# Altium schematic sheet Lora_module_CPU.SchDoc
size A4
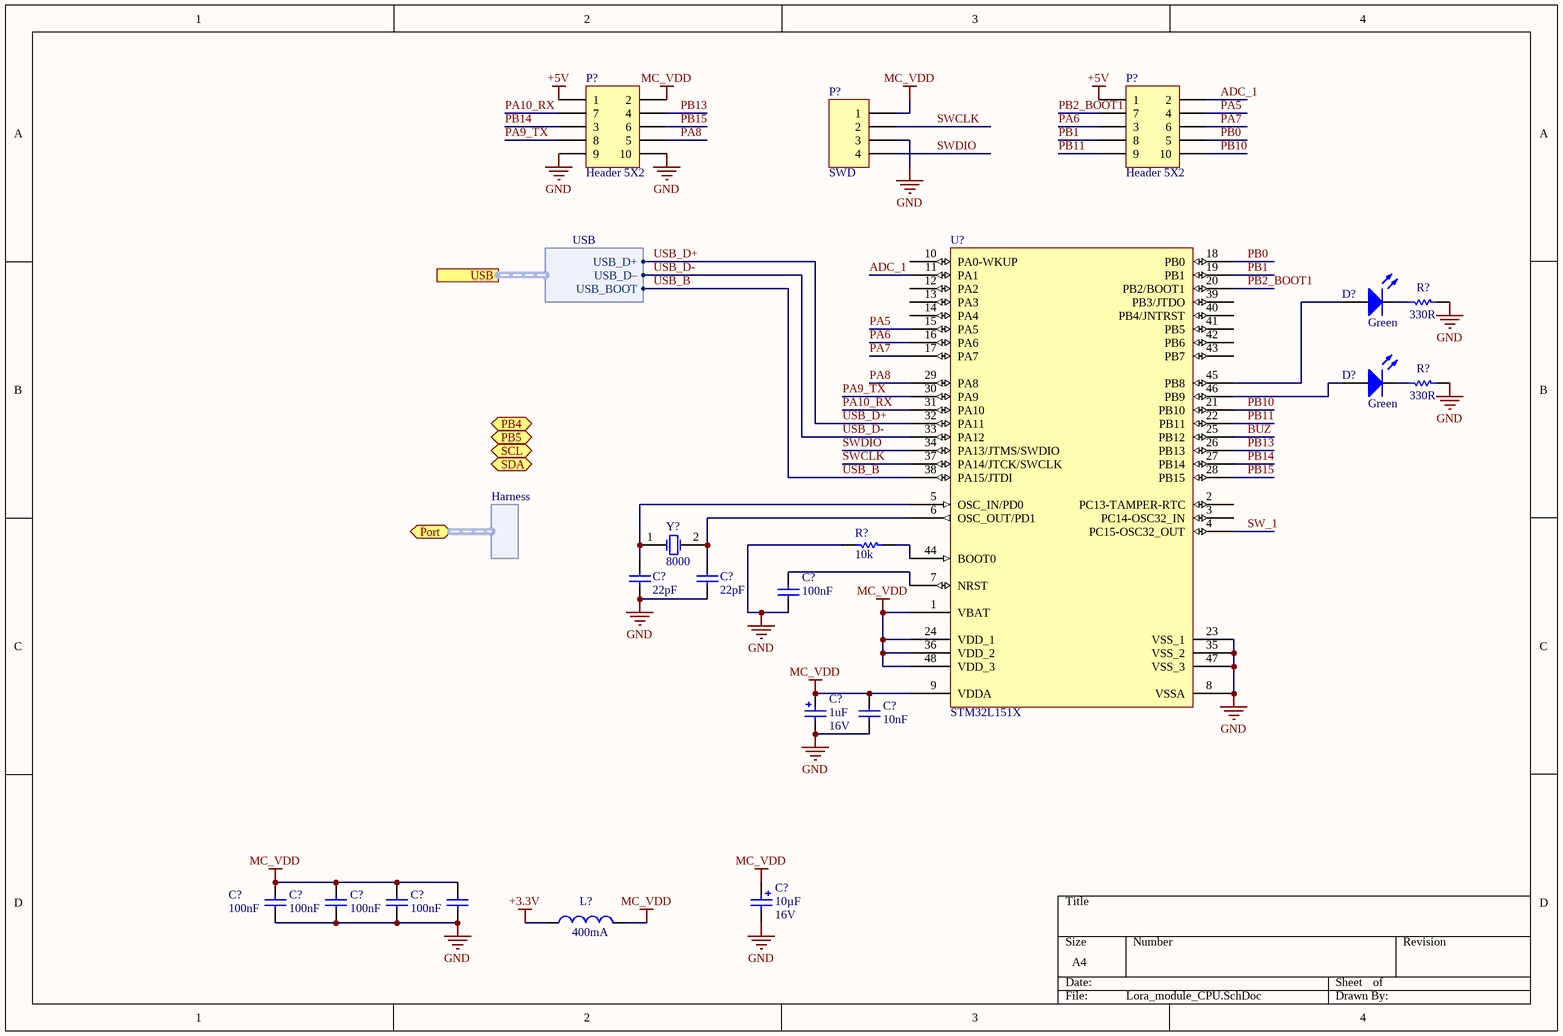
[diagram p0: Lora_module_CPU.SchDoc]

## Parts
(Parts that share a designator on the sheet are numbered #1, #2 ... from top to bottom, then left to right.)
C?#1  value 22pF  [SMD(0805)]  (hidden comment: Cap)
C?#2  value 22pF  [SMD(0805)]  (hidden comment: Cap)
C?#3  Capacitance: 100nF  [Cap 0603]  (hidden comment: Capacitor)
C?#4  Capacitance: 1uF  Voltage Rating: 16V  [Tantalum 3216 A]  (hidden comment: Capacitor Polarized)
C?#5  Capacitance: 10nF  [Cap 0603]  (hidden comment: Capacitor)
C?#6  Capacitance: 10µF  Voltage - Rated: 16V  [Tantalum 3216 A]  (hidden comment: Capacitor Polarized)
C?#7  Capacitance: 100nF  [Cap 0603]  (hidden comment: Capacitor)
C?#8  Capacitance: 100nF  [Cap 0603]  (hidden comment: Capacitor)
C?#9  Capacitance: 100nF  [Cap 0603]  (hidden comment: Capacitor)
C?#10  Capacitance: 100nF  [Cap 0603]  (hidden comment: Capacitor)
D?#1  Colour: Green  [Led 0805 green]  (hidden comment: LED)
D?#2  Colour: Green  [Led 0805 green]  (hidden comment: LED)
L?  Current Rating (Max): 400mA  [0603]  (hidden comment: Inductor)
P?#1  Header 5X2  [HDR2X5]
P?#2  Header 5X2  [HDR2X5]
P?#3  SWD  [Header 1X4]
R?#1  Resistance: 330R  [Res-0603]  (hidden comment: Res1)
R?#2  Resistance: 330R  [Res-0603]  (hidden comment: Res1)
R?#3  Resistance: 10k  [Res-0603]  (hidden comment: Res1)
U?  STM32L151X  [LQFP48_N]
Y?  8000  [XTAL1]

## Ports
PB4 (bidir), PB5, Port (harness Harness), SCL, SDA, USB (harness USB)

## Harnesses
Harness: 
USB: USB_BOOT, USB_D–, USB_D+

## Nets
+3.3V: L?.1
+5V: P?#1.1 P?#2.1
GND: C?#1.1 C?#2.1 C?#3.1 C?#4.2 C?#5.1 C?#6.2 C?#7.1 C?#8.1 C?#9.1 C?#10.1 P?#1.9 P?#1.10 P?#3.3 R?#1.2 R?#2.2 R?#3.2 U?.8(VSSA) U?.23(VSS_1) U?.35(VSS_2) U?.47(VSS_3)
MC_VDD: C?#4.1 C?#5.2 C?#6.1 C?#7.2 C?#8.2 C?#9.2 C?#10.2 L?.2 P?#1.2 P?#3.1 U?.1(VBAT) U?.9(VDDA) U?.24(VDD_1) U?.36(VDD_2) U?.48(VDD_3)
ADC_1: P?#2.2 U?.11(PA1)
BUZ: U?.25(PB12)
PA5: P?#2.4 U?.15(PA5)
PA6: P?#2.3 U?.16(PA6)
PA7: P?#2.6 U?.17(PA7)
PA8: P?#1.5 U?.29(PA8)
PA9_TX: P?#1.8 U?.30(PA9)
PA10_RX: P?#1.7 U?.31(PA10)
PB0: P?#2.5 U?.18(PB0)
PB1: P?#2.8 U?.19(PB1)
PB2_BOOT1: P?#2.7 U?.20(PB2/BOOT1)
PB10: P?#2.10 U?.21(PB10)
PB11: P?#2.9 U?.22(PB11)
PB13: P?#1.4 U?.26(PB13)
PB14: P?#1.3 U?.27(PB14)
PB15: P?#1.6 U?.28(PB15)
SW_1: U?.4(PC15-OSC32_OUT)
SWCLK: P?#3.2 U?.37(PA14/JTCK/SWCLK)
SWDIO: P?#3.4 U?.34(PA13/JTMS/SWDIO)
USB_B: U?.38(PA15/JTDI) ; port USB.USB_BOOT
USB_D+: U?.32(PA11) ; port USB.USB_D+
USB_D-: U?.33(PA12) ; port USB.USB_D–
NetC?#1_2: C?#1.2 U?.5(OSC_IN/PD0) Y?.1(OSC1)
NetC?#2_2: C?#2.2 U?.6(OSC_OUT/PD1) Y?.2(OSC2)
NetC?#3_2: C?#3.2 U?.7(NRST)
NetD?#1_1: D?#1.1(A) U?.45(PB8)
NetD?#1_2: D?#1.2(K) R?#1.1
NetD?#2_1: D?#2.1(A) U?.46(PB9)
NetD?#2_2: D?#2.2(K) R?#2.1
NetR?#3_1: R?#3.1 U?.44(BOOT0)

Not connected (* = marked no-connect by the designer): U? 2(PC13-TAMPER-RTC) 3(PC14-OSC32_IN) 10(PA0-WKUP) 12(PA2) 13(PA3) 14(PA4) 39(PB3/JTDO) 40(PB4/JNTRST) 41(PB5) 42(PB6) 43(PB7)

## Library data of the parts
C?#1 C?#2 = Cap: Capacitor
C?#3 C?#7-C?#10 = 1: Chip Capacitor Nonpolar; Manufacturer: Samsung; Manufacturer Part Number: CL10B104KB8NNNC; Material: Ceramic; Dielectric: X7R; Tolerance: 10%; Voltage Rating: 50V; ComponentLink1URL: http://www.kemet.com/docfinder?Partnumber=C0603C104K5RACTU; ComponentLink1Description: http://www.kemet.com/docfinder?Partnumber=C0603C104K5RACTU; Supplier 1: Digi-Key; Supplier Part Number 1: 1276-1000-1-ND; RoHS: Yes; Stock 1: 17762403; Pricing 1: 1 = 0,10000, 10 = 0,02800, 100 = 0,01230, 500 = 0,00878, 1000 = 0,00690 (USD); Mount: Surface Mount; Case/Package: 0603; Case Code (Metric): 1608; Case Code (Imperial): 0603; Contact Plating: Tin; Min Operating Temperature: -55°C; Max Operating Temperature: 125°C; Package Quantity: 1; Packaging: Tape and Reel; Voltage: 50V; Voltage Rating (DC): 50V; Length: 1.6mm; Height: 0.8mm; Depth: 0.8mm; Width: 0.031inch; Thickness: 0.035inch; Radiation Hardening: No; Lead Free: Lead Free; ComponentLink2URL: https://datasheet.ciiva.com/25803/cl10b104kb8nnnc-25803393.pdf?src-supplier=Digi-Key; ComponentLink2Description: https://datasheet.ciiva.com/25803/cl10b104kb8nnnc-25803393.pdf?src-supplier=Digi-Key; ComponentLink3URL: https://datasheet.ciiva.com/26838/getdatasheetpartid-89097-26838411.pdf?src-supplier=Verical; ComponentLink3Description: https://datasheet.ciiva.com/26838/getdatasheetpartid-89097-26838411.pdf?src-supplier=Verical; ComponentLink4URL: https://datasheet.ciiva.com/29198/456651-da-01-en-vs-kondensator-0605-29198839.pdf?src-supplier=Conrad; ComponentLink4Description: https://datasheet.ciiva.com/29198/456651-da-01-en-vs-kondensator-0605-29198839.pdf?src-supplier=Conrad
C?#4 = 2: Tantalum Capacitor; Manufacturer: Vishay Sprague; Manufacturer Part Number: 293D105X9016A2TE3; Tolerance: 10%; ESR (Equivalent Series Resistance): 9.3R; Ripple Current: 90mA; Leakage Current: 500nA; Polarity: Polar; Dissipation Factor: 4%; ComponentLink1URL: http://www.kemet.com/Lists/ProductCatalog/Attachments/254/KEM_T2005_T491.pdf; ComponentLink1Description: http://www.kemet.com/Lists/ProductCatalog/Attachments/254/KEM_T2005_T491.pdf; Supplier 1: Digi-Key; Supplier Part Number 1: 718-1113-6-ND; Stock 1: 0; Pricing 1: 1=0.33, 10=0.228, 100=0.1369, 500=0.1027, 1000=0.08672 (USD); Mount: Surface Mount,PCB; Case/Package: 1206; Case Code (Metric): 3216; Case Code (Imperial): 1206; Dielectric Material: Tantalum; Min Operating Temperature: -55°C; Max Operating Temperature: 125°C; Packaging: Tape and Reel; Package Quantity: 1; Voltage Rating (DC): 16V; Termination: SMD/SMT; Voltage: 16V; Features: General Purpose; Length: 3.2mm; Height: 1.6mm; Width: 1.6mm; Height - Seated (Max): 0.071inch; Depth: 1.6mm; Radiation Hardening: No; REACH SVHC: Unknown; Lead Free: Lead Free; ComponentLink2URL: https://datasheet.ciiva.com/11793/0900766b80d97b37-11793487.pdf; ComponentLink2Description: https://datasheet.ciiva.com/11793/0900766b80d97b37-11793487.pdf; ComponentLink3URL: https://datasheet.ciiva.com/26328/453930-da-01-en-smd-kondensator-293d105x9016a2te3-2000st-26328789.pdf; ComponentLink3Description: https://datasheet.ciiva.com/26328/453930-da-01-en-smd-kondensator-293d105x9016a2te3-2000st-26328789.pdf; ComponentLink4URL: https://datasheet.ciiva.com/257/293d-257909.pdf; ComponentLink4Description: https://datasheet.ciiva.com/257/293d-257909.pdf; ComponentLink5URL: https://datasheet.ciiva.com/257/293d-257910.pdf; ComponentLink5Description: https://datasheet.ciiva.com/257/293d-257910.pdf; ComponentLink6URL: https://datasheet.ciiva.com/16199/293d-16199270.pdf; ComponentLink6Description: https://datasheet.ciiva.com/16199/293d-16199270.pdf; ComponentLink7URL: https://datasheet.ciiva.com/257/293d-257911.pdf; ComponentLink7Description: https://datasheet.ciiva.com/257/293d-257911.pdf; ComponentLink8URL: https://datasheet.ciiva.com/3003/293d-3003799.pdf; ComponentLink8Description: https://datasheet.ciiva.com/3003/293d-3003799.pdf; ComponentLink9URL: https://datasheet.ciiva.com/11244/293d-11244087.pdf; ComponentLink9Description: https://datasheet.ciiva.com/11244/293d-11244087.pdf; ComponentLink10URL: https://datasheet.ciiva.com/46382/1910915-46382039.pdf; ComponentLink10Description: https://datasheet.ciiva.com/46382/1910915-46382039.pdf; ComponentLink11URL: https://datasheet.ciiva.com/3003/293d-3003800.pdf; ComponentLink11Description: https://datasheet.ciiva.com/3003/293d-3003800.pdf; ComponentLink12URL: https://datasheet.ciiva.com/18445/70212567-18445480.pdf; ComponentLink12Description: https://datasheet.ciiva.com/18445/70212567-18445480.pdf; ComponentLink13URL: https://datasheet.ciiva.com/1463/438417-1463146.pdf; ComponentLink13Description: https://datasheet.ciiva.com/1463/438417-1463146.pdf; ComponentLink14URL: https://datasheet.ciiva.com/12884/293d-239871-12884475.pdf; ComponentLink14Description: https://datasheet.ciiva.com/12884/293d-239871-12884475.pdf; ComponentLink15URL: https://datasheet.ciiva.com/22695/438417-22695102.pdf; ComponentLink15Description: https://datasheet.ciiva.com/22695/438417-22695102.pdf; ComponentLink16URL: https://datasheet.ciiva.com/6071/1748031-6071279.pdf; ComponentLink16Description: https://datasheet.ciiva.com/6071/1748031-6071279.pdf
C?#5 = 1: Chip Capacitor Nonpolar; Manufacturer: Samsung; Manufacturer Part Number: CL10B103KB8WPNC; Voltage Rating: 50V; Tolerance: 10%; ComponentLink1URL: http://www.kemet.com/docfinder?Partnumber=C0603C104K5RACTU; ComponentLink1Description: http://www.kemet.com/docfinder?Partnumber=C0603C104K5RACTU; Supplier 1: Digi-Key; Supplier Part Number 1: 1276-6841-6-ND; Stock 1: 11590; Pricing 1: 1=0.1, 10=0.076, 100=0.0338, 500=0.02416, 1000=0.01898 (USD); Mount: Surface Mount; Case/Package: 0603; Case Code (Metric): 1608; Case Code (Imperial): 0603; Min Operating Temperature: -55°C; Max Operating Temperature: 125°C; Packaging: Tape and Reel; Length: 0.063inch; Width: 0.031inch; Thickness: 0.035inch; Lead Free: Lead Free
C?#6 = 2: Tantalum Capacitor; Manufacturer: Kemet; Manufacturer Part Number: T491A106K016AT; Manufacturer Size Code: A; Tolerance: ±10%; ESR (Equivalent Series Resistance): 7 Ohm; Type: Molded; Lifetime @ Temp.: 2000 Hrs @ 85°C; Supplier 1: Digi-Key; Supplier Part Number 1: 399-8269-1-ND; RoHS: RoHS Compliant; Category: Capacitors; Stock 1: 46669; Pricing 1: 1=0.41, 10=0.362, 50=0.2198, 100=0.181, 250=0.14476, 500=0.13184, 1000=0.11891 (USD); Packaging: Cut Tape (CT); Operating Temperature: -55°C ~ 125°C; Mounting Type: Surface Mount; Package / Case: 1206 (3216 Metric); Size / Dimension: 0.126" L x 0.063" W (3.20mm x 1.60mm); Height - Seated (Max): 0.071" (1.80mm); Lead Spacing: -; Features: General Purpose; ComponentLink1URL: http://www.kemet.com/Lists/ProductCatalog/Attachments/254/KEM_T2005_T491.pdf; ComponentLink1Description: http://www.kemet.com/Lists/ProductCatalog/Attachments/254/KEM_T2005_T491.pdf
D?#1 D?#2 = 3: Led 0805; Manufacturer: Vishay Lite-On; Manufacturer Part Number: LTST-S220GKT; ID: 3; Lens Colour: Clear,Colorless; Viewing Angle: 130°; Lens Style: Clear,Diffused,Colorless,Rectangular; Luminous Intensity: 10mcd; Forward Voltage: 2.1V; Forward Current: 30mA; Power Rating: 100mW; Dominant Wavelength: 569nm; Test Current: 20mA; Lens Transparency: Clear; Number of Elements: 1; Wavelength: 565nm; Reverse Voltage: 5V; Supplier 1: Digi-Key; Supplier Part Number 1: 160-1218-6-ND; Stock 1: 87001; Pricing 1: 1=0.27, 10=0.199, 25=0.1464, 100=0.1045, 250=0.07108, 500=0.0627, 1000=0.04912 (USD); Mount: Surface Mount; Case/Package: 0805; Number of Pins: 2; Case Code (Metric): 2012; Case Code (Imperial): 0805; Min Operating Temperature: -55°C; Max Operating Temperature: 85°C; Package Quantity: 1; Packaging: Tape and Reel; Illumination Colour: Green; Power Dissipation: 100mW; Number of LEDs: 1; Length: 2.1mm; Height: 0.6mm; Width: 1mm; Depth: 0.6mm; Radiation Hardening: No; Lead Free: Lead Free; ComponentLink1URL: https://datasheet.ciiva.com/2110/ltst-s220gkt-2110016.pdf; ComponentLink1Description: https://datasheet.ciiva.com/2110/ltst-s220gkt-2110016.pdf; ComponentLink2URL: https://datasheet.ciiva.com/11775/0900766b80dc0b6e-11775442.pdf; ComponentLink2Description: https://datasheet.ciiva.com/11775/0900766b80dc0b6e-11775442.pdf; ComponentLink3URL: https://datasheet.ciiva.com/15118/getdatasheetpartid-221136-15118117.pdf; ComponentLink3Description: https://datasheet.ciiva.com/15118/getdatasheetpartid-221136-15118117.pdf; ComponentLink4URL: https://datasheet.ciiva.com/2110/ltst-s220gkt-2110017.pdf; ComponentLink4Description: https://datasheet.ciiva.com/2110/ltst-s220gkt-2110017.pdf; ComponentLink5URL: https://datasheet.ciiva.com/16444/ltst-s220gkt-16444773.pdf; ComponentLink5Description: https://datasheet.ciiva.com/16444/ltst-s220gkt-16444773.pdf
L? = 3: Sumida inductore ferrite core smd; Manufacturer: Murata Electronics North America; Manufacturer Part Number: BLM18AG102SN1D; Number of Lines: 1; Impedance @ Frequency: 1 kOhm @ 100MHz; DC Resistance (DCR) (Max): 500 mOhm; Supplier 1: Digi-Key; Supplier Part Number 1: 490-1015-1-ND; RoHS: RoHS Compliant; Category: Filters; Stock 1: 607561; Pricing 1: 1=0.1, 10=0.079, 50=0.0648, 100=0.0476, 250=0.0346, 500=0.0317, 1000=0.02738 (USD); Packaging: Cut Tape (CT); Filter Type: -; Ratings: -; Operating Temperature: -55°C ~ 125°C; Package / Case: 0603 (1608 Metric); Mounting Type: Surface Mount; Height (Max): 0.037" (0.95mm); Size / Dimension: 0.063" L x 0.031" W (1.60mm x 0.80mm); ComponentLink1URL: http://search.murata.co.jp/Ceramy/image/img/PDF/ENG/L0110S0100BLM18A.pdf; ComponentLink1Description: http://search.murata.co.jp/Ceramy/image/img/PDF/ENG/L0110S0100BLM18A.pdf
P?#1 P?#2 = Header 5X2: Header, 5-Pin, Dual row; LatestRevisionDate: 17-Jul-2002; LatestRevisionNote: Re-released for DXP Platform.; Publisher: Altium Limited
P?#3 = 5: Header 1X4; ID: 5; LatestRevisionDate: 17-Jul-2002; LatestRevisionNote: Re-released for DXP Platform.; Publisher: Altium Limited
R?#1 R?#2 = 1: Chip Resistor; Manufacturer: Panasonic; Manufacturer Part Number: ERJ-3EKF3300V; Tolerance: 1%; Power Rating: 100mW; Voltage Rating (DC): 75V; Temperature Coefficient: 100ppm/°C; ComponentLink1URL: http://industrial.panasonic.com/www-cgi/jvcr13pz.cgi?E+PZ+3+AOA0002+ERJ6ENF3000V+7+WW; ComponentLink1Description: http://industrial.panasonic.com/www-cgi/jvcr13pz.cgi?E+PZ+3+AOA0002+ERJ6ENF3000V+7+WW; Supplier 1: Digi-Key; Supplier Part Number 1: P330HDKR-ND; Stock 1: 924496; Pricing 1: 1=0.1, 10=0.079, 100=0.0323, 1000=0.01449, 2500=0.01258 (USD); Mount: Surface Mount; Case/Package: 0603; Number of Pins: 2; Weight: 7.1E-05oz; Case Code (Imperial): 0603; Case Code (Metric): 1608; Contact Plating: Tin; Min Operating Temperature: -55°C; Max Operating Temperature: 155°C; Packaging: Tape and Reel; Voltage Rating: 75V; Package Quantity: 1; Composition: Thick Film; Termination: SMD/SMT; Number of Terminations: 2; Military Standard: Not; Max Power Dissipation: 100mW; Features: Automotive AEC-Q200; Length: 1.6mm; Height: 0.022inch; Width: 0.8mm; Depth: 0.8mm; Radiation Hardening: No; REACH SVHC: No SVHC; Lead Free: Lead Free; ComponentLink2URL: https://datasheet.ciiva.com/7886/aoa0000ce2-7886729.pdf; ComponentLink2Description: https://datasheet.ciiva.com/7886/aoa0000ce2-7886729.pdf; ComponentLink3URL: https://datasheet.ciiva.com/48531/aoa0000ce2-48531001.pdf; ComponentLink3Description: https://datasheet.ciiva.com/48531/aoa0000ce2-48531001.pdf; ComponentLink4URL: https://datasheet.ciiva.com/22721/426256-22721099.pdf; ComponentLink4Description: https://datasheet.ciiva.com/22721/426256-22721099.pdf; ComponentLink5URL: https://datasheet.ciiva.com/46373/1678782-46373899.pdf; ComponentLink5Description: https://datasheet.ciiva.com/46373/1678782-46373899.pdf; ComponentLink6URL: https://datasheet.ciiva.com/9117/aoa0000ce2-9117132.pdf; ComponentLink6Description: https://datasheet.ciiva.com/9117/aoa0000ce2-9117132.pdf; ComponentLink7URL: https://datasheet.ciiva.com/46373/1678782-46373900.pdf; ComponentLink7Description: https://datasheet.ciiva.com/46373/1678782-46373900.pdf
R?#3 = 1: Chip Resistor; Manufacturer: Panasonic; Manufacturer Part Number: ERJ-3GEYJ103V; Tolerance: 5%; Power Rating: 100mW; Voltage Rating: 75V; Temperature Coefficient: 200ppm/°C; Voltage Rating (DC): 50V; Supplier 1: Digi-Key; Supplier Part Number 1: P10KGDKR-ND; Stock 1: 10740434; Pricing 1: 1=0.1, 10=0.054, 100=0.022, 1000=0.00988, 2500=0.00858 (USD); Mount: Surface Mount; Case/Package: 0603; Weight: 7.1E-05oz; Case Code (Imperial): 0603; Case Code (Metric): 1608; Contact Plating: Tin; Min Operating Temperature: -55°C; Max Operating Temperature: 155°C; Packaging: Tape and Reel; Package Quantity: 1; Composition: Thick Film; Termination: SMD/SMT; Number of Terminations: 2; Military Standard: Not; Max Power Dissipation: 100mW; Working Voltage: 75V; Features: Automotive AEC-Q200; Length: 1.6mm; Height: 0.45mm; Width: 0.8mm; Depth: 0.8mm; REACH SVHC: No SVHC; Lead Free: Lead Free; ComponentLink1URL: https://datasheet.ciiva.com/34303/2007265-34303757.pdf; ComponentLink1Description: https://datasheet.ciiva.com/34303/2007265-34303757.pdf; ComponentLink2URL: https://datasheet.ciiva.com/11809/0900766b80f806dd-11809566.pdf; ComponentLink2Description: https://datasheet.ciiva.com/11809/0900766b80f806dd-11809566.pdf; ComponentLink3URL: https://datasheet.ciiva.com/28514/1678796-28514213.pdf; ComponentLink3Description: https://datasheet.ciiva.com/28514/1678796-28514213.pdf; ComponentLink4URL: https://datasheet.ciiva.com/30147/4aoa0000ce1-30147029.pdf; ComponentLink4Description: https://datasheet.ciiva.com/30147/4aoa0000ce1-30147029.pdf; ComponentLink5URL: https://datasheet.ciiva.com/46371/1678796-46371909.pdf; ComponentLink5Description: https://datasheet.ciiva.com/46371/1678796-46371909.pdf; ComponentLink6URL: https://datasheet.ciiva.com/24133/aoa0000ce1-37422-24133064.pdf; ComponentLink6Description: https://datasheet.ciiva.com/24133/aoa0000ce1-37422-24133064.pdf; ComponentLink7URL: https://datasheet.ciiva.com/46385/1678796-46385240.pdf; ComponentLink7Description: https://datasheet.ciiva.com/46385/1678796-46385240.pdf; ComponentLink8URL: https://datasheet.ciiva.com/17212/aoa0000ce1-17212106.pdf; ComponentLink8Description: https://datasheet.ciiva.com/17212/aoa0000ce1-17212106.pdf; ComponentLink9URL: https://datasheet.ciiva.com/9117/aoa0000ce1-9117038.pdf; ComponentLink9Description: https://datasheet.ciiva.com/9117/aoa0000ce1-9117038.pdf; ComponentLink10URL: https://datasheet.ciiva.com/16740/aoa0000ce1-16740655.pdf; ComponentLink10Description: https://datasheet.ciiva.com/16740/aoa0000ce1-16740655.pdf; ComponentLink11URL: https://datasheet.ciiva.com/48531/aoa0000ce1-48531887.pdf; ComponentLink11Description: https://datasheet.ciiva.com/48531/aoa0000ce1-48531887.pdf
U? = STM32F103CBT6: STM32 ARM-based 32-bit MCU with 128 Kbytes Flash, 48-pin LQFP, Industrial Temperature; Published: 30-May-2008; DatasheetVersion: rev6, Mar-2008; PackageVersion: Mar-2008; PackageReference: LQFP48; Publisher: Altium Limited; PackageDescription: 48-Pin Low-Profile Quad Flat Pack, 7 x 7 mm Body, 0.5 mm Pitch (LQFP48); ComponentLink1Description: Manufacturer Link; ComponentLink1URL: www.st.com/stm32; ComponentLink2Description: Datasheet; ComponentLink2URL: http://www.st.com/stonline/products/literature/ds/13587.pdf
Y? = XTAL: Crystal Oscillator